# Altium schematic sheet Measure.SchDoc
size A; SheetNumber: 3; SheetTotal: 6
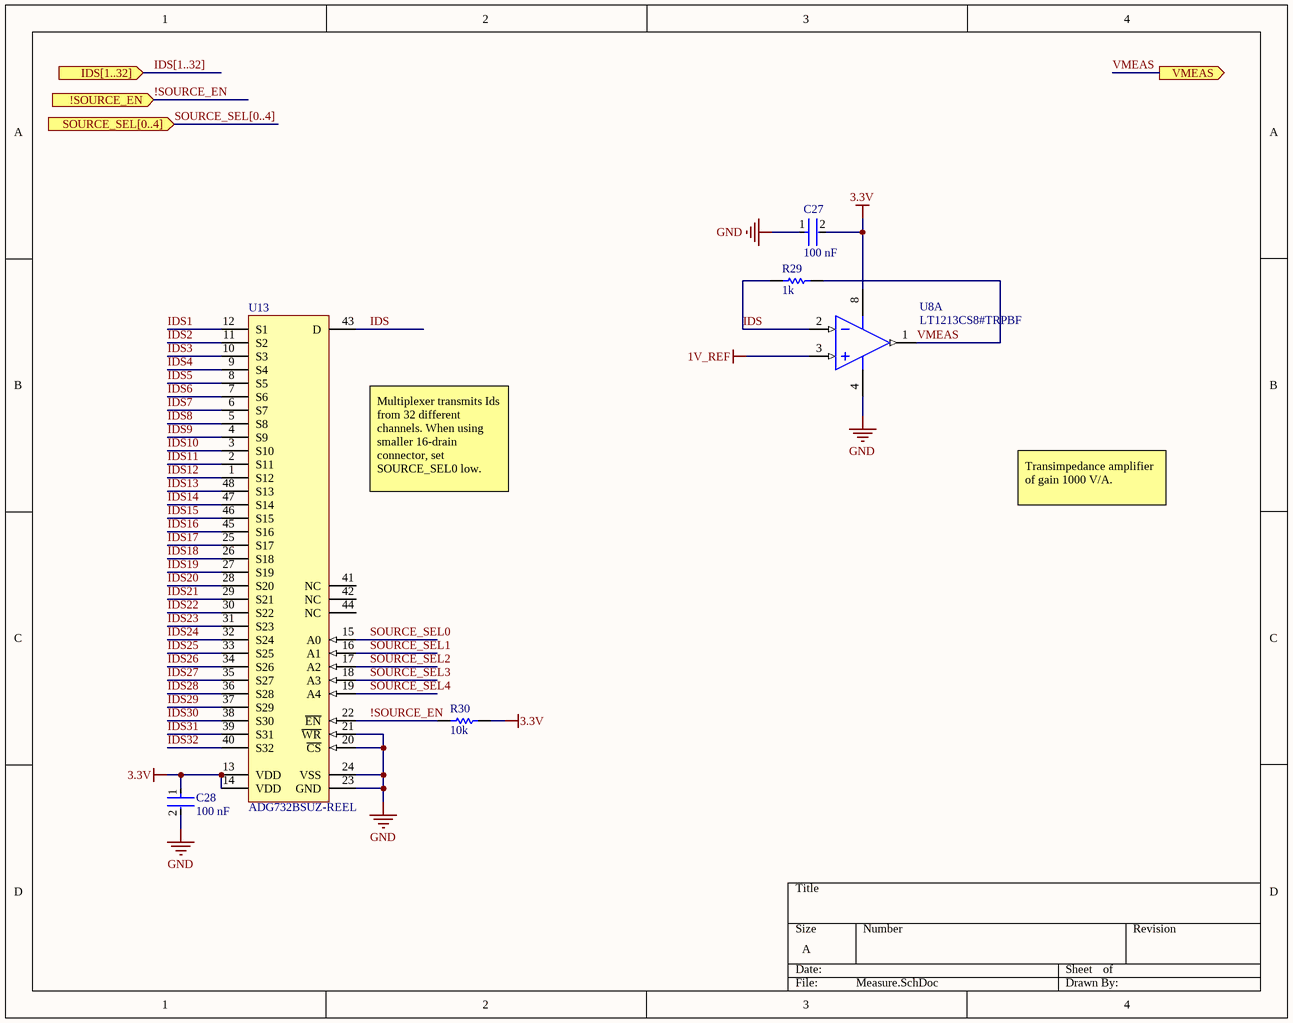
[diagram p0: Measure.SchDoc]

## Parts
C27  100 nF  [FP-C0805C-DN-MFG]
C28  100 nF  [FP-C0805C-DN-MFG]
R29  1k  [RESC2013X55X40LL15T20]
R30  10k  [RESC2013X60X35NL10T20]
U8  LT1213CS8#TRPBF  [LT-S8-8_N]  (part A of 2)
U13  ADG732BSUZ-REEL  [ADI-SU-48_N]

## Ports
!SOURCE_EN (in), IDS[1..32] (in), SOURCE_SEL[0..4] (in), VMEAS (out)

## Nets
1V_REF: U8.3(+IN_A)
3.3V: C27.2 C28.1 R30.1 U8.8(V+) U13.13(VDD) U13.14(VDD)
GND: C27.1 C28.2 U8.4(V-) U13.20(~{CS}) U13.21(~{WR}) U13.23(GND) U13.24(VSS)
!SOURCE_EN: R30.2 U13.22(~{EN}) ; port !SOURCE_EN
IDS: R29.1 U8.2(-IN_A) U13.43(D)
IDS1: U13.12(S1)
IDS2: U13.11(S2)
IDS3: U13.10(S3)
IDS4: U13.9(S4)
IDS5: U13.8(S5)
IDS6: U13.7(S6)
IDS7: U13.6(S7)
IDS8: U13.5(S8)
IDS9: U13.4(S9)
IDS10: U13.3(S10)
IDS11: U13.2(S11)
IDS12: U13.1(S12)
IDS13: U13.48(S13)
IDS14: U13.47(S14)
IDS15: U13.46(S15)
IDS16: U13.45(S16)
IDS17: U13.25(S17)
IDS18: U13.26(S18)
IDS19: U13.27(S19)
IDS20: U13.28(S20)
IDS21: U13.29(S21)
IDS22: U13.30(S22)
IDS23: U13.31(S23)
IDS24: U13.32(S24)
IDS25: U13.33(S25)
IDS26: U13.34(S26)
IDS27: U13.35(S27)
IDS28: U13.36(S28)
IDS29: U13.37(S29)
IDS30: U13.38(S30)
IDS31: U13.39(S31)
IDS32: U13.40(S32)
SOURCE_SEL0: U13.15(A0)
SOURCE_SEL1: U13.16(A1)
SOURCE_SEL2: U13.17(A2)
SOURCE_SEL3: U13.18(A3)
SOURCE_SEL4: U13.19(A4)
VMEAS: R29.2 U8.1(OUT_A) ; port VMEAS

Not connected (* = marked no-connect by the designer): U13 41(NC) 42(NC) 44(NC)

## Buses and harness runs
bus IDS[1..32] = port IDS[1..32]
bus SOURCE_SEL[0..4] = port SOURCE_SEL[0..4]

## Notes on the sheet
- (near U13) Multiplexer transmits Ids from 32 different channels. When using smaller 16-drain connector, set SOURCE_SEL0 low.
- Transimpedance amplifier of gain 1000 V/A.

## Library data of the parts
C27 C28 = CMP-2007-00279-2: CAP CER 0.1UF 50V X7R 0805; Manufacturer Part Number: C0805C104K5RACTU; Manufacturer: KEMET; Value: 0.10 μF; Tolerance: 0.1; Temperature Coefficient: 30ppm/°C; Material: Ceramic; Device Class L2: Capacitors; Temperature Range Low: -55°C; Voltage Rating: 50 V; Digikey Description: CAP CER 0.1UF 50V X7R 0805; Category: Cap; ComponentLink2Description: Datasheet; Octopart: https://octopart.com/c0805c104k5ractu-kemet-143926; RoHS: TRUE; ComponentLink2URL: https://content.kemet.com/datasheets/KEM_C1003_C0G_SMD.pdf; Temperature Characteristic: X7R; Temperature: -55°C to +125°C; Height: 0.88mm; Temperature Range High: +125°C; Device Class L1: Passive Components; Automotive: No; Lead Free: Yes; Ipc Land Pattern Name: CAPC200125X78; Device Class L3: Ceramic Capacitors; Mouser Description: Cap Ceramic 0.1uF 50V X7R 10% SMD 2.0 x 1.2 mm 125 C Paper T/R; Capacitance: 0.10 μF; Package: C0805C-DN
R29 = CMP-2001-04738-1: TNPW08051K00BEEN; Manufacturer: Vishay Dale; Part Number: TNPW08051K00BEEN
R30 = CMP-1659-00013-4: Chip Resistor, 10 KOhm, +/- 1%, 0.125 W, -55 to 155 degC, 0805 (2012 Metric), RoHS, Tape and Reel; Manufacturer: Yageo; Voltage Rating: 150 V; Mount: Surface Mount; ComponentLink1Description: Manufacturer URL; ComponentLink2URL: http://www.yageo.com/documents/recent/PYu-RC_Group_51_RoHS_L_04.pdf; Pins: 2; Length: 2 mm; Min Operating Temperature: -55 degC; Height: 0.5 mm; Mounting Technology: Surface Mount; RoHSCompliant: true; REACH SVHC: No SVHC; ComponentLink1URL: http://www.yageo.com/; Max Operating Temperature: 155 degC; PackageReference: 0805; DatasheetVersion: Rev. 4, 02/2016; Package Quantity: 5000; Packaging: Tape and Reel; ComponentLink2Description: Datasheet; PackageDescription: 2-Pin Surface Mounted Device, Body 2 x 1.25 mm
U8 = CMP-0359-03127-2: Dual Channel, Precision, Fast Operational Amplifier, 28 MHz Typical GBW, 8.5 V/us Typical SR, 2.5 to 36 V, 8-Pin SOIC (S8-8), Commercial, Pb-Free, Reel; Linear Technology Part Number: LT1213; Manufacturer: Linear Technology; Vos (mV) Typical: 0.075; Vs Max (V): 36; SR (V/us) Typical: 8.5; GBW (MHz) Typical: 28; Vs Min (V): 2.5; Is (mA) Typical: 2.7; Channels (#): 2; ComponentLink2Description: Datasheet; ComponentLink1Description: Manufacturer URL; RoHS: Pb-Free; DatasheetVersion: Rev. A; RevisionNote: URLs updated; Packing: Reel; ComponentLink3Description: Package Specification; ComponentLink2URL: http://cds.linear.com/docs/en/datasheet/12134fa.pdf; ComponentLink3URL: http://cds.linear.com/docs/en/packaging/05081610_G_SO8.pdf; Mounting Technology: Surface Mount; Type: VFB; PartNumber: LT1213CS8#TRPBF; PackageDescription: 8-Pin Plastic Small Outline, Body 4.9 x 3.9 mm, Pitch 1.27 mm; ComponentLink1URL: http://www.linear.com/; PackageVersion: Rev G; PackageReference: LT-S8-8
U13 = CMP-0798-00236-1: 1.8 to 5.5 V / +/-2.5 V, 4 Ohm, 32-Channel Analog Multiplexer, -40 to 85 degC, 48-pin QFP (SU-48), Reel; Manufacturer: Analog Devices; Ron (ohms): 4; Max Analog Signal Range: Vss to Vdd; Bandwidth (Hz): 18M; Supply V Guar Performance: Dual_(+/-2.5V), Single_(+3V), Single_(+5V); t transition (s): 23n; PackageReference: SU-48; ComponentLink3URL: http://www.analog.com/static/imported-files/packages/470644706845302410119987SU48_7x7.pdf; PartNumber: ADG732BSUZ-REEL; ComponentLink1URL: http://www.analog.com/en/index.html; Mounting Technology: Surface Mount; ComponentLink2Description: Datasheet; Packing: Reel; ComponentLink1Description: Manufacturer URL; DatasheetVersion: Rev. 0; ComponentLink2URL: http://www.analog.com/static/imported-files/data_sheets/ADG726_732.pdf; PackageDescription: 48-Pin Thin Plastic Quad Flat Package, Body 7 x 7 mm, Pitch 0.5 mm; Code_JEDEC: MS-026ABC; ComponentLink3Description: Package Specification